# EAGLE design SparkFun_Wireless_JoyStick (EAGLE 7.6.0)

## Sheet 1 of 2
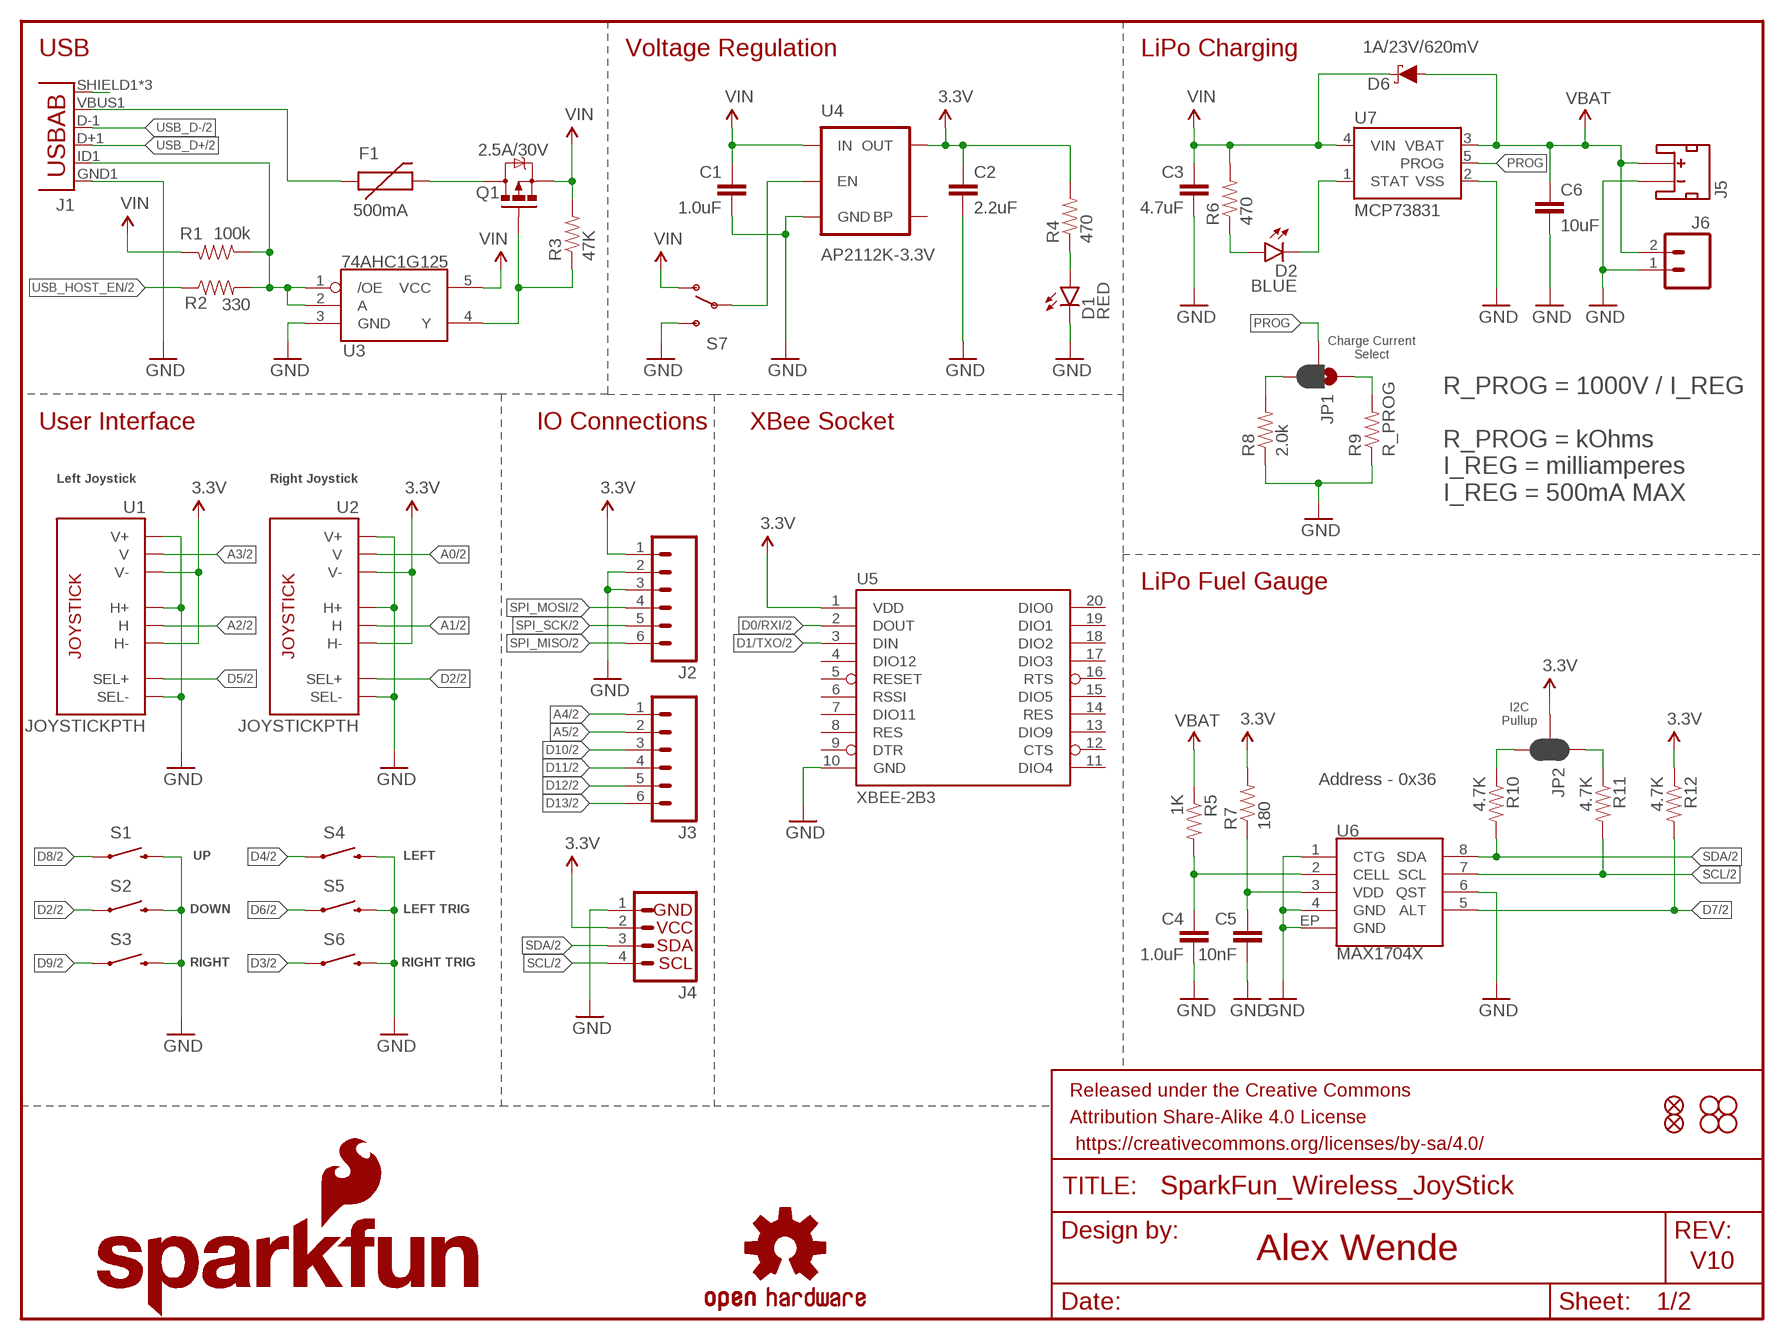
[diagram p0: schematic, sheet 1]

### Parts
C1  1.0uF  1.0UF-25V-+80/-20(0805)"  [0805-CAP]
C2  2.2uF  2.2UF-10V-20%(0603)  [0603-CAP]
C3  4.7uF  4.7UF-6.3V-10%(0603)0603  [0603-CAP]
C4  1.0uF  1.0UF-16V-10%(0603)  [0603-CAP]
C5  10nF  10NF/10000PF-50V-10%(0603)  [0603-CAP]
C6  10uF  10UF-6.3V-20%(0603)  [0603-CAP]
D1  RED  LED-RED0603  [LED-0603]
D2  BLUE  LED-BLUE0603  [LED-0603]
D6  1A/23V/620mV  DIODE-SCHOTTKY-BAT20J  [SOD-323]
F1  500mA  PTCSMD  [PTC-1206]
FD1  FIDUCIALUFIDUCIAL  [MICRO-FIDUCIAL]
FD2  FIDUCIALUFIDUCIAL  [MICRO-FIDUCIAL]
FRAME1  FRAME-LETTER  [CREATIVE_COMMONS]
H1  STAND-OFF  [STAND-OFF]
H2  STAND-OFF  [STAND-OFF]
H3  STAND-OFF  [STAND-OFF]
H4  STAND-OFF  [STAND-OFF]
J1  USB-ABCONN-11794  [USB-AB-MICRO-SMD_V03]
J2  M06NO_SILK_FEMALE_PTH  [1X06_NO_SILK]
J3  M06NO_SILK_FEMALE_PTH  [1X06_NO_SILK]
J4  I2C_STANDARD_NO_SILK  [1X04_NO_SILK]
J5  JST_2MM_MALE  [JST-2-SMD]
J6  M021X02_NO_SILK  [1X02_NO_SILK]
JP1  JUMPER-PAD-3-2OF3_NC_BY_PASTE  [PAD-JUMPER-3-2OF3_NC_BY_PASTE_YES_SILK_FULL_BOX]
JP2  JUMPER-PAD-3-NC_BY_PASTE  [PAD-JUMPER-3-NC_BY_PASTE_YES_SILK_FULL_BOX]
LOGO1  SFE_LOGO_NAME_FLAME.3_INCH  [SFE_LOGO_NAME_FLAME_.3]
LOGO2  OSHW-LOGOL  [OSHW-LOGO-L]
Q1  2.5A/30V  MOSFET-PCHANNELDMG2307L  [SOT23-3@1]
R1  100k  100KOHM-1/10W-1%(0603)  [0603-RES]
R2  330  330OHM1/10W1%(0603)  [0603-RES]
R3  47K  47KOHM1/10W1%(0603)  [0603-RES]
R4  470  470OHM1/10W1%(0603)  [0603-RES]
R5  1K  1KOHM-1/10W-1%(0603)  [0603-RES]
R6  470  470OHM1/10W1%(0603)  [0603-RES]
R7  180  180OHM1/10W1%(0603)  [0603-RES]
R8  2.0k  2.0KOHM1/10W5%(0603)  [0603-RES]
R9  R_PROG  RESISTORPTH-1/4W  [AXIAL-0.4]
R10  4.7K  4.7KOHM-1/10W-1%(0603)  [0603-RES]
R11  4.7K  4.7KOHM-1/10W-1%(0603)  [0603-RES]
R12  4.7K  4.7KOHM-1/10W-1%(0603)  [0603-RES]
S1  SWITCH-MOMENTARY-212MM  [TACTILE-PTH-12MM]
S2  SWITCH-MOMENTARY-212MM  [TACTILE-PTH-12MM]
S3  SWITCH-MOMENTARY-212MM  [TACTILE-PTH-12MM]
S4  SWITCH-MOMENTARY-212MM  [TACTILE-PTH-12MM]
S5  SWITCH-MOMENTARY-2SIDE_EZ  [TACTILE-PTH-SIDEEZ]
S6  SWITCH-MOMENTARY-2SIDE_EZ  [TACTILE-PTH-SIDEEZ]
S7  SWITCH_SPDT  [KPS-1290]
U1  JOYSTICKPTH  [JOYSTICK]
U2  JOYSTICKPTH  [JOYSTICK]
U3  74AHC1G125  [SOT23-5]
U4  AP2112K-3.3V  V_REG_LDOSMD  [SOT23-5]
U5  XBEE-2B3  [XBEE-SMD]
U6  MAX1704X  [TDFN-8]
U7  MCP73831  [SOT23-5]

### Nets
3.3V: C2.1 J2.1 J4.2 JP2.2 R4.2 R7.2 R12.1 U1.H3(H-) U1.V3(V-) U2.H3(H-) U2.V3(V-) U4.5(OUT) U5.1(VDD) ; also sheet 2
A0: U2.V2(V) ; also sheet 2
A1: U2.H2(H) ; also sheet 2
A2: U1.H2(H) ; also sheet 2
A3: U1.V2(V) ; also sheet 2
A4: J3.1 ; also sheet 2
A5: J3.2 ; also sheet 2
D0/RXI: U5.2(DOUT) ; also sheet 2
D1/TXO: U5.3(DIN) ; also sheet 2
D2: S2.1 U2.B1A(SEL+) ; also sheet 2
D3: S6.1 ; also sheet 2
D4: S4.1 ; also sheet 2
D5: U1.B1A(SEL+) ; also sheet 2
D6: S5.1 ; also sheet 2
D7: R12.2 U6.5(ALT) ; also sheet 2
D8: S1.1 ; also sheet 2
D9: S3.1 ; also sheet 2
D10: J3.3 ; also sheet 2
D11: J3.4 ; also sheet 2
D12: J3.5 ; also sheet 2
D13: J3.6 ; also sheet 2
GND: C1.2 C2.2 C3.2 C4.2 C5.2 C6.2 D1.C J1.GND1(GND) J2.2 J2.3 J4.1 J5.1(-) J6.1 R8.1 R9.P$1 S1.3 S2.3 S3.3 S4.3 S5.2 S6.2 S7.S U1.B2A(SEL-) U1.H1(H+) U1.V1(V+) U2.B2A(SEL-) U2.H1(H+) U2.V1(V+) U3.3(GND) U4.2(GND) U5.10(GND) U6.1(CTG) U6.4(GND) U6.6(QST) U6.EP(GND) U7.2(VSS) ; also sheet 2
N$2: JP2.1 R11.1
N$3: JP2.3 R10.1
N$4: JP1.1 R9.P$2
N$9: F1.1 J1.VBUS1(VBUS)
N$12: C5.1 R7.1 U6.3(VDD)
N$13: S7.P U4.3(EN)
N$14: F1.2 Q1.3(D)
N$15: J1.ID1(USBID) R1.1 R2.2 U3.1(/OE) U3.2(A)
N$16: C4.1 R5.2 U6.2(CELL)
N$17: JP1.3 R8.2
N$19: D2.A R6.1
N$20: D2.C U7.1(STAT)
N$23: D1.A R4.1
N$25: Q1.1(G) R3.1 U3.4(Y)
PROG: JP1.2 U7.5(PROG)
SCL: J4.4 R11.2 U6.7(SCL) ; also sheet 2
SDA: J4.3 R10.2 U6.8(SDA) ; also sheet 2
SHIELD: J1.SHIELD1(SHIELD) J1.SHIELD2(SHIELD) J1.SHIELD3(SHIELD)
SPI_MISO: J2.6 ; also sheet 2
SPI_MOSI: J2.4 ; also sheet 2
SPI_SCK: J2.5 ; also sheet 2
USB_D+: J1.D+1(D+) ; also sheet 2
USB_D-: J1.D-1(D-) ; also sheet 2
USB_HOST_EN: R2.1 ; also sheet 2
VBAT: C6.1 D6.A J5.2(+) J6.2 R5.1 U7.3(VBAT)
VIN: C1.1 C3.1 D6.C Q1.2(S) R1.2 R3.2 R6.2 S7.O U3.5(VCC) U4.1(IN) U7.4(VIN)
Unconnected: J5.NC1(PAD1) J5.NC2(PAD2) U4.4(BP) U5.4(DIO12) U5.5(RESET) U5.6(RSSI) U5.7(DIO11) U5.8(RES) U5.9(DTR) U5.11(DIO4) U5.12(CTS) U5.13(DIO9) U5.14(RES) U5.15(DIO5) U5.16(RTS) U5.17(DIO3) U5.18(DIO2) U5.19(DIO1) U5.20(DIO0)

### Notes on the sheet
- USB | Voltage Regulation | LiPo Charging
- Charge Current
  Select
- R_PROG = 1000V / I_REG
- User Interface | IO Connections | XBee Socket
- Left Joystick | Right Joystick
- R_PROG = kOhms
  I_REG = milliamperes
  I_REG = 500mA MAX
- LiPo Fuel Gauge
- I2C
  Pullup
- Address - 0x36
- UP | LEFT
- DOWN | LEFT TRIG
- RIGHT | RIGHT TRIG
- Alex Wende
- V10

## Sheet 2 of 2
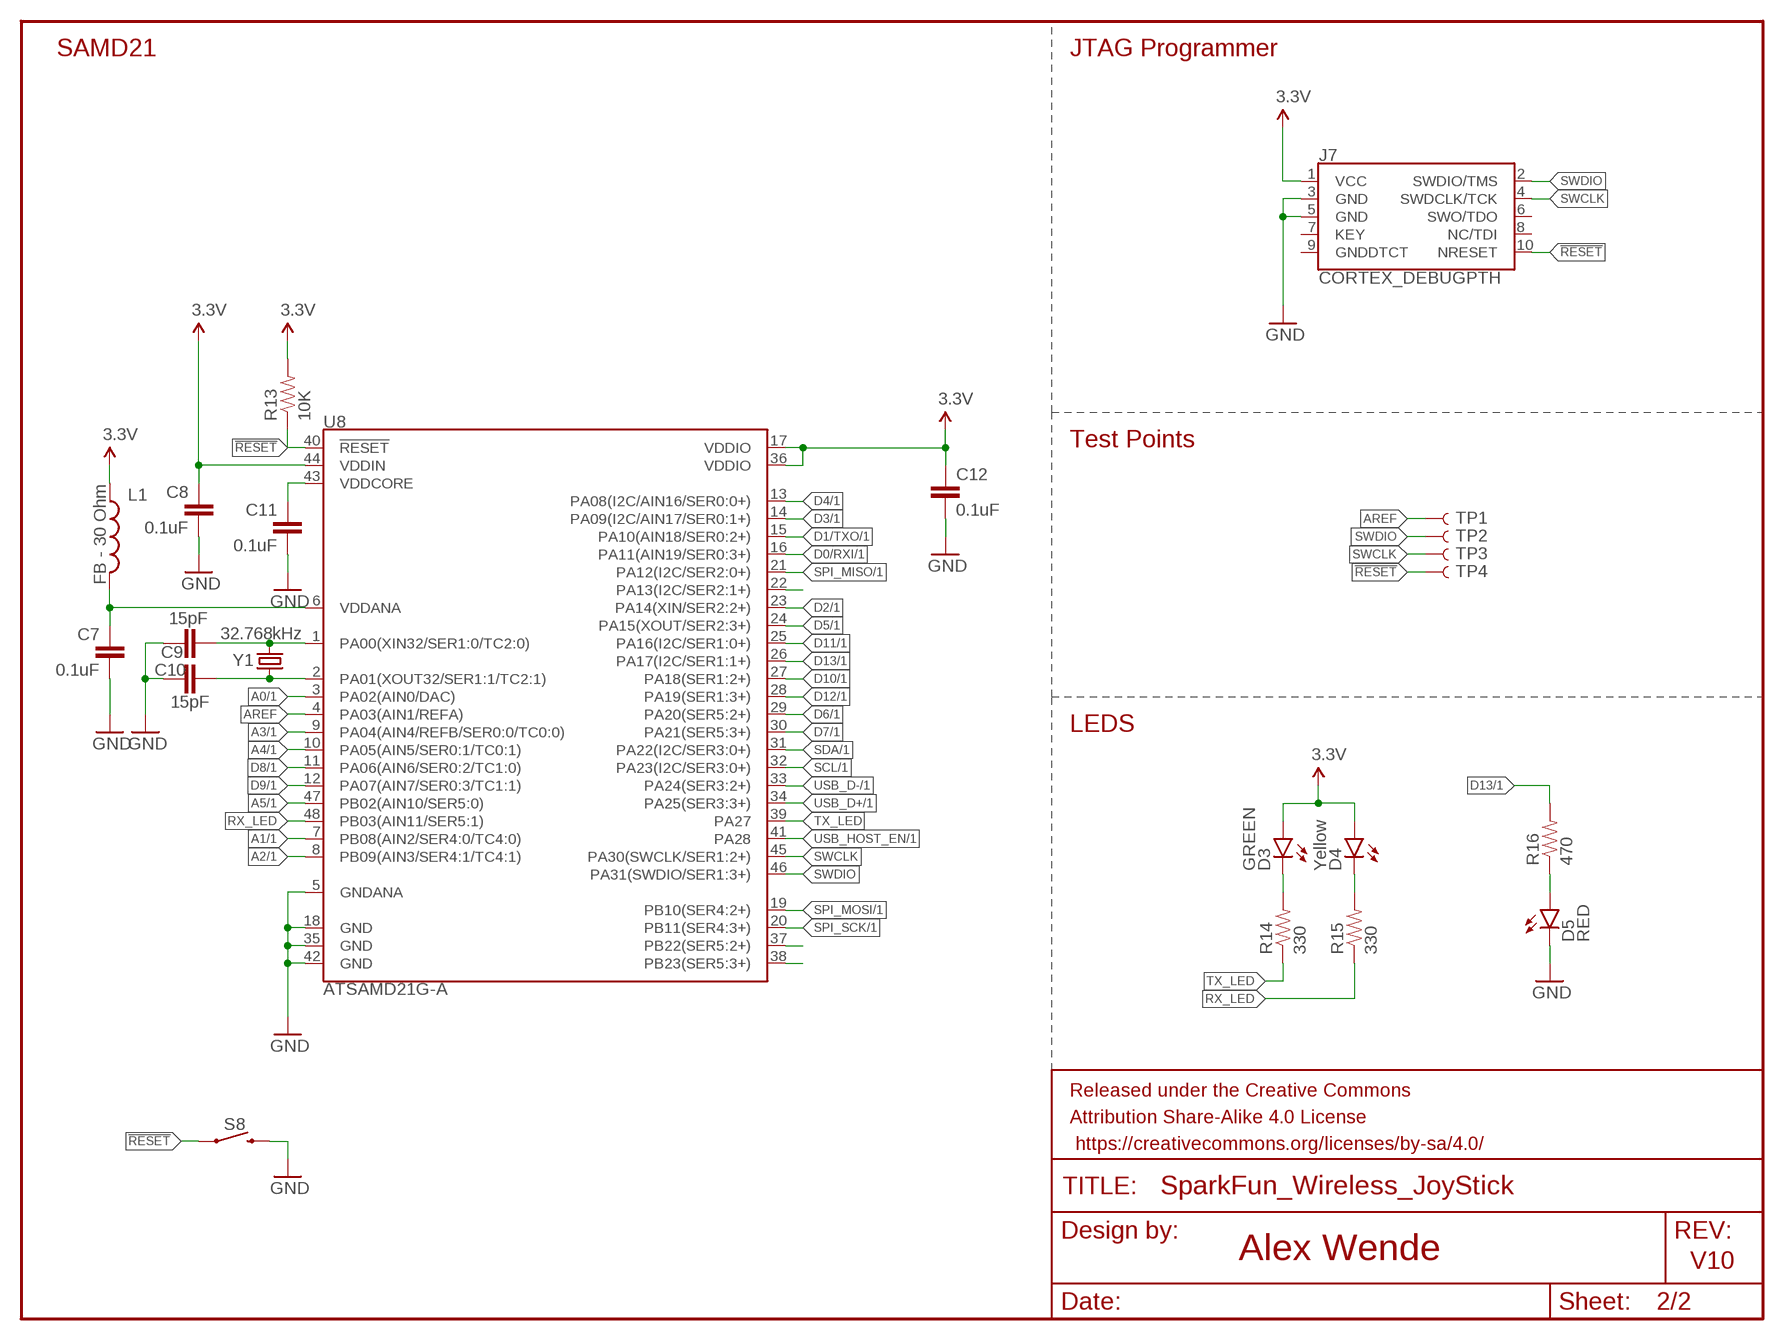
[diagram p1: schematic, sheet 2]

### Parts
C7  0.1uF  0.1UF-25V(+80/-20%)(0603)  [0603-CAP]
C8  0.1uF  0.1UF-25V(+80/-20%)(0603)  [0603-CAP]
C9  15pF  15PF-50V-5%(0603)  [0603-CAP]
C10  15pF  15PF-50V-5%(0603)  [0603-CAP]
C11  0.1uF  0.1UF-25V(+80/-20%)(0603)  [0603-CAP]
C12  0.1uF  0.1UF-25V(+80/-20%)(0603)  [0603-CAP]
D3  GREEN  LED-GREEN0603  [LED-0603]
D4  Yellow  LED-YELLOW0603  [LED-0603]
D5  RED  LED-RED0603  [LED-0603]
FRAME2  FRAME-LETTERNO_PACKAGE  [DUMMY]
J7  CORTEX_DEBUGPTH  [2X5-PTH-1.27MM]
L1  FB - 30 Ohm  INDUCTOR30OHM,1.8A  [0603]
R13  10K  10KOHM-1/10W-1%(0603)0603  [0603-RES]
R14  330  330OHM1/10W1%(0603)  [0603-RES]
R15  330  330OHM1/10W1%(0603)  [0603-RES]
R16  470  470OHM1/10W1%(0603)  [0603-RES]
S8  MOMENTARY-SWITCH-SPST-SMD-4.6X2.8MM  [TACTILE_SWITCH_SMD_4.6X2.8MM]
TP1  TEST-POINT3  [PAD.03X.03]
TP2  TEST-POINT3  [PAD.03X.03]
TP3  TEST-POINT3  [PAD.03X.03]
TP4  TEST-POINT3  [PAD.03X.03]
U8  ATSAMD21G-A  [TQFP-48]
Y1  32.768kHz  CRYSTAL3.2X1.5MM  [CRYSTAL-SMD-3.2X1.5MM]

### Nets
3.3V: C8.1 C12.1 D3.A D4.A J7.1(VCC) L1.1 R13.2 U8.17(VDDIO) U8.36(VDDIO) U8.44(VDDIN) ; also sheet 1
!RESET: J7.10(NRESET) R13.1 S8.1 S8.2 TP4.P$1 U8.40(!RESET!)
A0: U8.3(PA02(AIN0/DAC)) ; also sheet 1
A1: U8.7(PB08(AIN2/SER4:0/TC4:0)) ; also sheet 1
A2: U8.8(PB09(AIN3/SER4:1/TC4:1)) ; also sheet 1
A3: U8.9(PA04(AIN4/REFB/SER0:0/TC0:0)) ; also sheet 1
A4: U8.10(PA05(AIN5/SER0:1/TC0:1)) ; also sheet 1
A5: U8.47(PB02(AIN10/SER5:0)) ; also sheet 1
AREF: TP1.P$1 U8.4(PA03(AIN1/REFA))
D0/RXI: U8.16(PA11(AIN19/SER0:3+)) ; also sheet 1
D1/TXO: U8.15(PA10(AIN18/SER0:2+)) ; also sheet 1
D2: U8.23(PA14(XIN/SER2:2+)) ; also sheet 1
D3: U8.14(PA09(I2C/AIN17/SER0:1+)) ; also sheet 1
D4: U8.13(PA08(I2C/AIN16/SER0:0+)) ; also sheet 1
D5: U8.24(PA15(XOUT/SER2:3+)) ; also sheet 1
D6: U8.29(PA20(SER5:2+)) ; also sheet 1
D7: U8.30(PA21(SER5:3+)) ; also sheet 1
D8: U8.11(PA06(AIN6/SER0:2/TC1:0)) ; also sheet 1
D9: U8.12(PA07(AIN7/SER0:3/TC1:1)) ; also sheet 1
D10: U8.27(PA18(SER1:2+)) ; also sheet 1
D11: U8.25(PA16(I2C/SER1:0+)) ; also sheet 1
D12: U8.28(PA19(SER1:3+)) ; also sheet 1
D13: R16.2 U8.26(PA17(I2C/SER1:1+)) ; also sheet 1
GND: C7.2 C8.2 C9.1 C10.1 C11.2 C12.2 D5.C J7.3(GND) J7.5(GND) S8.3 S8.4 U8.5(GNDANA) U8.18(GND) U8.35(GND) U8.42(GND) ; also sheet 1
N$1: D4.C R15.2
N$5: U8.37(PB22(SER5:2+))
N$6: U8.38(PB23(SER5:3+))
N$7: D5.A R16.1
N$8: U8.22(PA13(I2C/SER2:1+))
N$10: D3.C R14.2
N$18: C11.1 U8.43(VDDCORE)
N$21: C9.2 U8.1(PA00(XIN32/SER1:0/TC2:0)) Y1.P$2
N$22: C10.2 U8.2(PA01(XOUT32/SER1:1/TC2:1)) Y1.P$1
N$24: C7.1 L1.2 U8.6(VDDANA)
RX_LED: R15.1 U8.48(PB03(AIN11/SER5:1))
SCL: U8.32(PA23(I2C/SER3:0+)) ; also sheet 1
SDA: U8.31(PA22(I2C/SER3:0+)) ; also sheet 1
SPI_MISO: U8.21(PA12(I2C/SER2:0+)) ; also sheet 1
SPI_MOSI: U8.19(PB10(SER4:2+)) ; also sheet 1
SPI_SCK: U8.20(PB11(SER4:3+)) ; also sheet 1
SWCLK: J7.4(SWDCLK/TCK) TP3.P$1 U8.45(PA30(SWCLK/SER1:2+))
SWDIO: J7.2(SWDIO/TMS) TP2.P$1 U8.46(PA31(SWDIO/SER1:3+))
TX_LED: R14.1 U8.39(PA27)
USB_D+: U8.34(PA25(SER3:3+)) ; also sheet 1
USB_D-: U8.33(PA24(SER3:2+)) ; also sheet 1
USB_HOST_EN: U8.41(PA28) ; also sheet 1
Unconnected: J7.6(SWO/TDO) J7.7(KEY) J7.8(NC/TDI) J7.9(GNDDTCT)

### Notes on the sheet
- SAMD21 | JTAG Programmer
- Test Points
- LEDS
- Alex Wende
- V10

## Library data of the parts
C1 = SparkFun-Capacitors:1.0UF-25V-+80/-20(0805): CAP-11625; PROD_ID: CAP-11625
C2 = SparkFun-Capacitors:2.2UF-10V-20%(0603): CAP-07888; PROD_ID: CAP-07888
C3 = SparkFun-Capacitors:4.7UF-6.3V-10%(0603): CAP-08280; PROD_ID: CAP-08280
C4 = SparkFun-Capacitors:1.0UF-16V-10%(0603): CAP-00868; PROD_ID: CAP-00868
C5 = SparkFun-Capacitors:10NF/10000PF-50V-10%(0603): CAP-00867; PROD_ID: CAP-00867
C6 = SparkFun-Capacitors:10UF-6.3V-20%(0603): CAP-11015; PROD_ID: CAP-11015
C7 C8 C11 C12 = SparkFun-Capacitors:0.1UF-25V(+80/-20%)(0603): CAP-00810 Ceramic Standard decoupling cap; PROD_ID: CAP-00810
C9 C10 = SparkFun-Capacitors:15PF-50V-5%(0603): CAP-07881; PROD_ID: CAP-07881
D1 D5 = SparkFun-LED:LED-RED: Assorted Red LEDs LilyPad 1206- DIO-09912 1206- DIO-00809 0603- DIO-00819 "SMART" means more efficient and expensive; PROD_ID: DIO-00819
D2 = SparkFun-LED:LED-BLUE: Blue LEDs for production use Various blue LEDs stocked by SparkFun production 0603 - DIO-08575 Rebel - DIO-09553 1206 - DIO-09911; PROD_ID: DIO-08575
D3 = SparkFun-LED:LED-GREEN: Various green LEDs Green LEDs used in SFE Production 0603- DIO-00821 LARGE- DIO-00862 LILYPAD- DIO-09910; PROD_ID: DIO-00821
D4 = SparkFun-LED:LED-YELLOW: Yellow SMD LEDs LilyPad 1206- DIO-09909 0603- DIO-09003 "SMART" means more efficient and expensive; PROD_ID: DIO-09003
D6 = SparkFun-DiscreteSemi:DIODE-SCHOTTKY: Schottky diode A Schottky diode is a semiconductor diode which has a low forward voltage drop and a very fast switching action.; PROD_ID: DIO-11623
F1 = SparkFun-PowerIC:PTC: Resettable Fuse PTC Resettable Fuse. Spark Fun Electronics SKU : COM-08357; PROD_ID: RES-11150
FD1 FD2 = SparkFun-Aesthetics:FIDUCIAL: Fiducial Alignment Points Various fiducial points for machine vision alignment.
FRAME1 = SparkFun-Aesthetics:FRAME-LETTER: Schematic Frame Standard 8.5x11 US Letter frame
FRAME2 = SparkFun-Aesthetics:FRAME-LETTER: Schematic Frame Standard 8.5x11 US Letter frame; DESIGNER: Nobody; VERSION: v01
H1-H4 = SparkFun-Electromechanical:STAND-OFF: #4 Stand Off This is the mechanical footprint for a #4 phillips button head screw. Use the keepout ring to avoid running the screw head into surrounding components. SKU : PRT-00447
J1 = SparkFun-Connectors:USB-AB: This is a USB AB connector that is compatible with USB OTG. i.e. this connector can serve as a host or device; PROD_ID: CONN-11794
J2 J3 = SparkFun-Connectors:M06: Header 6 Standard 6-pin 0.1" header. Use with straight break away headers (SKU : PRT-00116), right angle break away headers (PRT-00553), swiss pins (PRT-00743), machine pins (PRT-00117), and female headers (PRT-00115). Molex polarized connector foot print use with SKU : PRT-08094 with associated crimp pins and housings. NOTES ON THE VARIANTS LOCK and LOCK_LONGPADS... This footprint was designed to help hold the alignment of a through-hole component (i.e. 6-pin header) while soldering it into place. You may notice that each hole has been shifted either up or down by 0.005 of an inch from it's more standard position (which is a perfectly straight line). This slight alteration caused the pins (the squares in the middle) to touch the edges of the holes. Because they are alternating, it causes a "brace" to hold the component in place. 0.005 has proven to be the perfect amount of "off-center" position when using our standard breakaway headers. Although looks a little odd when you look at the bare footprint, once you have a header in there, the alteration is very hard to notice. Also,if you push a header all the way into place, it is covered up entirely on the bottom side. This idea of altering the position of holes to aid alignment will be further integrated into the Sparkfun Library for other footprints. It can help hold any component with 3 or more connection pins.; PROD_ID: CONN-08437
J4 = SparkFun-Connectors:I2C_STANDARD: SparkFun has standardized on a pinout for all I2C based sensor breakouts. This pinout allows I2C boards to be plugged directly into the headers on Arduino Uno compatible boards, and to be daisy chained easily.
J5 = SparkFun-Connectors:JST_2MM_MALE: Mates to single-cell LiPo batteries. CONN-11443 Now with smashable polarity marks!; BTM_NEG: -; BTM_POS: +; PROD_ID: CONN-11443; TOP_NEG: -; TOP_POS: +
J6 = SparkFun-Connectors:M02: Standard 2-pin 0.1" header. Use with - straight break away headers ( PRT-00116) - right angle break away headers (PRT-00553) - swiss pins (PRT-00743) - machine pins (PRT-00117) - female headers (PRT-00115) Molex polarized connector foot print use with: PRT-08233 with associated crimp pins and housings. 2.54_SCREWTERM for use with PRT-10571. 3.5mm Screw Terminal footprints for PRT-08084 5mm Screw Terminal footprints for use with PRT-08432
J7 = SparkFun-Connectors:CORTEX_DEBUG: Cortex Debug Connector Datasheet <http://infocenter.arm.com/help/topic/com.arm.doc.faqs/attached/13634/cortex_debug_connectors.pdf>
JP1 = SparkFun-Passives:JUMPER-PAD-3-2OF3_NC_BY_PASTE
JP2 = SparkFun-Passives:JUMPER-PAD-3-NC_BY_PASTE
L1 = SparkFun-Passives:INDUCTOR: Inductors Basic Inductor/Choke - 0603 and 1206. Footprints are not proven and vary greatly between part numbers. INDUCTOR POWER 3.3UH 4.0A SMD 0.197" L x 0.197" W x 0.177" H (5.00mm x 5.00mm x 4.50mm); PROD_ID: NDUC-07859
LOGO1 = SparkFun-Aesthetics:SFE_LOGO_NAME_FLAME: SFE Logo, name and flame This is the SparkFun full logo. The logo on the schematic will always be the same size; the package variant is the height of the flame part of the logo. Default layer for the logo on the board is tSilk.
LOGO2 = SparkFun-Aesthetics:OSHW-LOGO: Open Source Hardware Logo This logo indicates the piece of hardware it is found on incorporates a OSHW license and/or adheres to the definition of open source hardware found here: http://freedomdefined.org/OSHW
Q1 = SparkFun-DiscreteSemi:MOSFET-PCHANNEL: Generic PMOSFET IRLML2244 - TRANS-11153 (SOT-23 -20V -4.3A) (1.Gate 2.Source 3.Drain) FQP27P06 - COM-10349 <http://www.sparkfun.com/products/10349> (TO-220 -60V -27A) (1.Gate 2.Source 3.Drain); PROD_ID: TRANS-11308
R1 = SparkFun-Resistors:100KOHM-1/10W-1%(0603): RES-07828; PROD_ID: RES-07828
R2 R14 R15 = SparkFun-Resistors:330OHM1/10W1%(0603): RES-00818; PROD_ID: RES-00818
R3 = SparkFun-Resistors:47KOHM1/10W1%(0603): RES-07871; PROD_ID: RES-07871
R4 R6 R16 = SparkFun-Resistors:470OHM1/10W1%(0603): RES-07869; PROD_ID: RES-07869
R5 = SparkFun-Resistors:1KOHM-1/10W-1%(0603): RES-07856; PROD_ID: RES-07856
R7 = SparkFun-Resistors:180OHM1/10W1%(0603): RES-08788; PROD_ID: RES-08788
R8 = SparkFun-Resistors:2.0KOHM1/10W5%(0603): RES-08296; PROD_ID: RES-08296
R9 = SparkFun-Resistors:RESISTOR: Resistor Basic schematic elements and footprints for 0603, 1206, and PTH resistors.
R10-R12 = SparkFun-Resistors:4.7KOHM-1/10W-1%(0603): RES-07857; PROD_ID: RES-07857
R13 = SparkFun-Resistors:10KOHM-1/10W-1%(0603): RES-00824; PROD_ID: RES-00824
S1-S4 = SparkFun-Electromechanical:SWITCH-MOMENTARY-2: Various NO switches- pushbuttons, reed, etc; PROD_ID: SWCH-09185
S5 S6 = SparkFun-Electromechanical:SWITCH-MOMENTARY-2: Various NO switches- pushbuttons, reed, etc
S7 = SparkFun-Electromechanical:SWITCH_SPDT: SWCH-10651 Side-actuated SPDT slide switch, as used on the Arduino Pro; PROD_ID: SWCH-10651
S8 = SparkFun-Switches:MOMENTARY-SWITCH-SPST: Momentary Switch (Pushbutton) - SPST Normally-open (NO) SPST momentary switches (buttons, pushbuttons). Variants PTH-12MM - 12mm square, through-hole Momentary Pushbutton Switch - 12mm Square <https://www.sparkfun.com/products/9190> (COM-09190) PTH-6.0MM, PTH-6.0MM-KIT - 6.0mm square, through-hole Mini Pushbutton Switch <https://www.sparkfun.com/products/97> (COM-00097) KIT package intended for soldering kit's - only one side of pads' copper is exposed. PTH-RIGHT-ANGLE-KIT - Right-angle, through-hole Right Angle Tactile Button <https://www.sparkfun.com/products/10791> - Used on SparkFun BigTime Watch Kit <https://www.sparkfun.com/products/11734> SMD-12MM - 12mm square, surface-mount Tactile Button - SMD (12mm) <https://www.sparkfun.com/products/12993> (COM-12993) Used on SparkFun PicoBoard <https://www.sparkfun.com/products/11888> SMD-4.5MM - 4.5mm Square Trackball Switch Used on SparkFun Blackberry Trackballer Breakout <https://www.sparkfun.com/products/13169> SMD-4.6MMX2.8MM - 4.60mm x 2.80mm, surface mount Used on SparkFun SAMD21 Mini Breakout <https://www.sparkfun.com/products/13664> SMD-5.2MM, SMD-5.2-REDUNDANT - 5.2mm square, surface-mount Mini Pushbutton Switch - SMD <https://www.sparkfun.com/products/8720> (COM-08720) Used on Arduino Pro Mini <https://www.sparkfun.com/products/11114> REDUNDANT package connects both switch circuits together SMD-6.0X3.5MM - 6.0 x 3.5mm, surface mount Momentary Reset Switch SMD <https://www.sparkfun.com/products/8229> (COM-08229) SMD-6.2MM-TALL - 6.2mm square, surface mount Tactile Button - SMD (6mm) <https://www.sparkfun.com/products/12992> Used on SparkFun Digital Sandbox <https://www.sparkfun.com/products/12651> SMD-RIGHT-ANGLE - Right-angle, surface mount Used on SparkFun Block for Intel® Edison - Arduino <https://www.sparkfun.com/products/13036>; PROD_ID: SWCH-13065
TP1-TP4 = SparkFun-Passives:TEST-POINT: Bare copper test points for troubleshooting or ICT
U1 U2 = SparkFun-Electromechanical:JOYSTICK: Thumb Joystick Joystick commonly found in PS2 controllers. Two pots and a select switch. Footprint proven. Spark Fun Electronics SKU : COM-09032
U3 = SparkFun-DigitalIC:74AHC1G125: Single bus buffer gate with 3-state output; PROD_ID: IC-11920
U4 = SparkFun-PowerIC:V_REG_LDO: Voltage Regulator LDO Standard 150mA LDO voltage regulator in SOT-23 layout. Micrel part MIC5205. BP (by-pass) pin is used to lower output noise with 470pF cap.; PROD_ID: VREG-12457
U5 = SparkFun-RF:XBEE-2: Xbee module footprints SMT header is CONN-09042.; PROD_ID: CONN-09042
U6 = SparkFun-PowerIC:MAX1704X: MAX17043/MAX17044: Battery Fuel Guage (43 is 1cell, 44 is 2cell); PROD-ID: IC-10399
U7 = SparkFun-PowerIC:MCP73831: Miniature single cell, fully integrated Li-Ion, Li-polymer charge management controller http://ww1.microchip.com/downloads/en/DeviceDoc/20001984g.pdf IC-09995; PROD_ID: IC-09995
U8 = SparkFun-DigitalIC:ATSAMD21G: Atmel SAMD21G SMART ARM-Based Microcontroller The Atmel ® | SMART ™ SAM D21 is a series of low-power microcontrollers using the 32-bit ARM ® Cortex ® -M0+ processor, and ranging from 32- to 64-pins with up to 256KB Flash and 32KB of SRAM. The SAM D21 devices operate at a maximum frequency of 48MHz and reach 2.46 CoreMark/MHz. They are designed for simple and intuitive migration with identical peripheral modules, hex compatible code, identical linear address map and pin compatible migration paths between all devices in the product series. All devices include intelligent and flexible peripherals, Atmel Event System for inter-peripheral signaling, and support for capacitive touch button, slider and wheel user interfaces.; PROD_ID: IC-13064
Y1 = SparkFun-FreqCtrl:CRYSTAL: Various standard crystals. Proven footprints.; PROD_ID: XTAL-13062

## Board
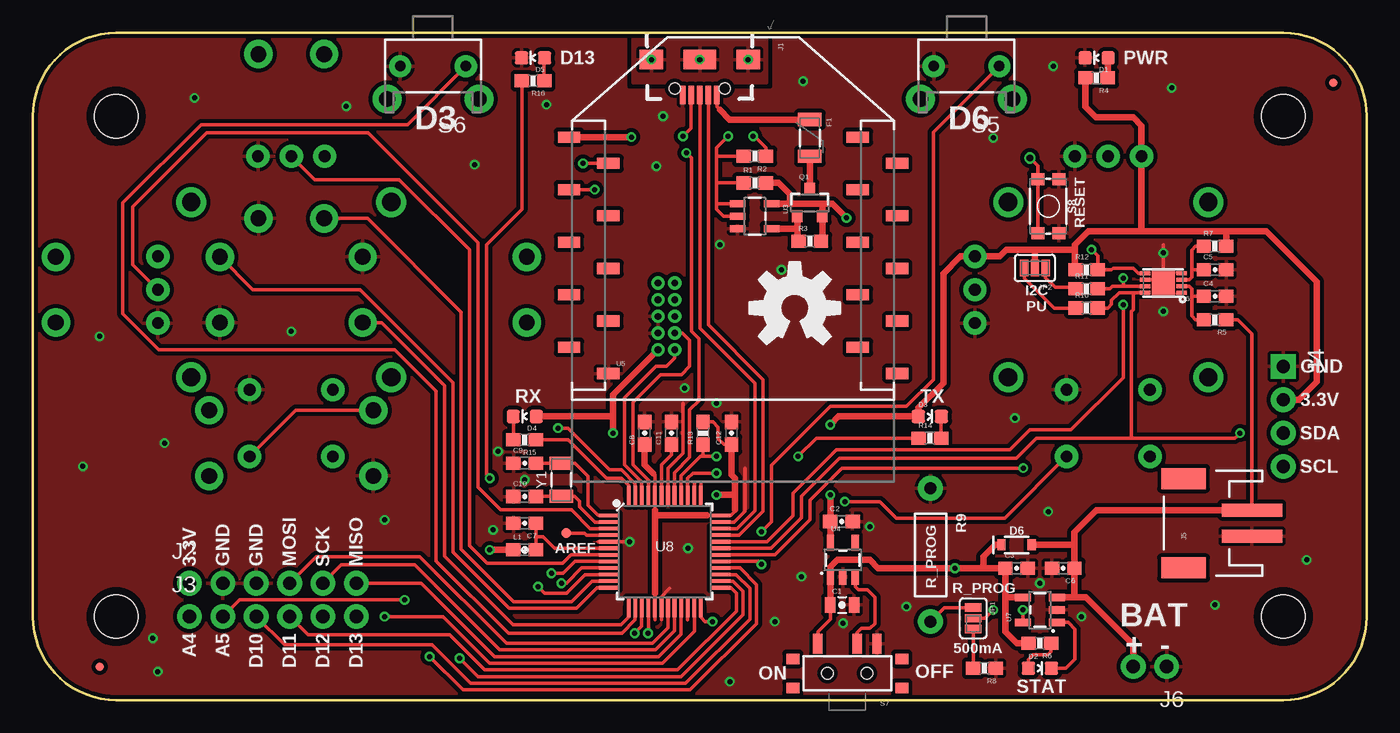
[diagram p2: board, top side]
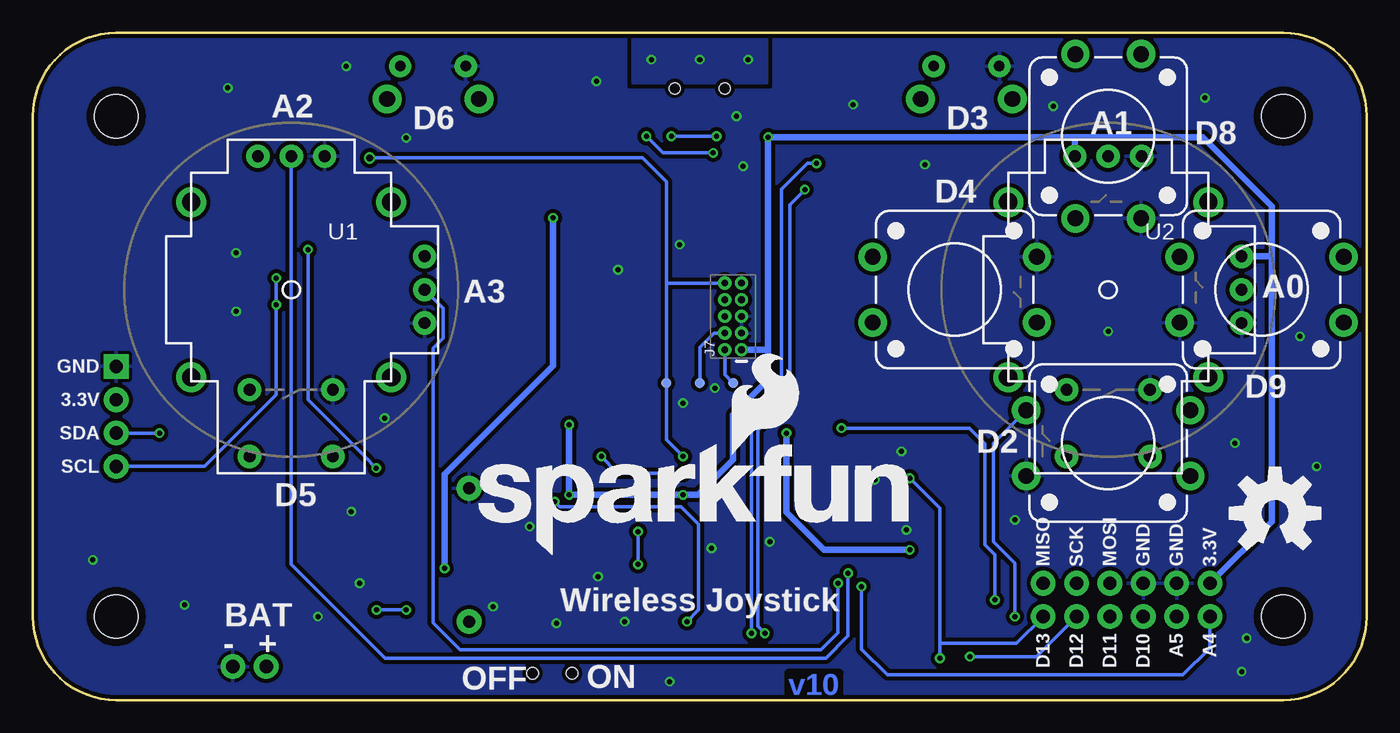
[diagram p3: board, bottom side, seen from below]

Size 101.6 x 50.8 mm. Coordinates in mm from the lower left corner, seen from the top.
Outline: 6.35,0 95.25,0 arc90 101.6,6.35 101.6,44.45 arc90 95.25,50.8 6.35,50.8 arc90 0,44.45 0,6.35 arc90 6.35,0
Copper layers (1*16): Top 0.035mm / dielectric 1.5mm / Bottom 0.035mm
Design rules "SparkFun-2-layer-TIGHT": minimum track width 7mil, minimum drill 15mil, track to track 7mil, track to pad 7mil, pad to pad 7mil, via to via 7mil, smd to smd 7mil, copper to edge 7mil, drill to drill 7mil, minimum pad ring 7mil, minimum via ring 7mil, stop-mask expansion 4mil, vias tented up to drill 25mil, thermal gap 10mil

### Footprints (pad centres in the part's own frame; a part is rotated, then mirrored left to right if it is on the bottom)
0805-CAP = smd 0.8 x 1.2: 1 -0.9,0; 2 0.9,0
0603-CAP = smd 1.1 x 1: 1 -0.85,0; 2 0.85,0
LED-0603 = smd 1 x 1: A 0,-0.877; C 0,0.877
SOD-323 = smd 0.63 x 0.83: A 1.15,0; C -1.15,0
PTC-1206 = smd 1 x 1.8: 1 -1.4,0; 2 1.4,0
MICRO-FIDUCIAL = smd 0.635 x 0.635: 1 0,0
STAND-OFF = hole 3.302: 0,0
USB-AB-MICRO-SMD_V03 = smd 1.4 x 0.4: D+1 2.7,0; D-1 2.7,0.65; GND1 2.7,-1.3; ID1 2.7,-0.65; VBUS1 2.7,1.3 | smd 1.5 x 1.8: SHIELD1 0,3.68; SHIELD3 0,-3.68 | smd 1.5 x 2.5: SHIELD2 0,0 | hole 0.85: 2.2,1.9; 2.2,-1.9
1X06_NO_SILK = drill 1.016 pad 1.88: 1 0,0; 2 2.54,0; 3 5.08,0; 4 7.62,0; 5 10.16,0; 6 12.7,0
1X04_NO_SILK = drill 1.016 pad 1.88 square: 1 0,0 | drill 1.016 pad 1.88: 2 2.54,0; 3 5.08,0; 4 7.62,0
JST-2-SMD = smd 1 x 4.6: 1 -1,-3.7; 2 1,-3.7 | smd 1.6 x 3.4: NC1 -3.4,1.5; NC2 3.4,1.5
1X02_NO_SILK = drill 1.016 pad 1.88: 1 0,0; 2 2.54,0
2X5-PTH-1.27MM = drill 0.508 pad 1: 1 -2.54,-0.635; 2 -2.54,0.635; 3 -1.27,-0.635; 4 -1.27,0.635; 5 0,-0.635; 6 0,0.635; 7 1.27,-0.635; 8 1.27,0.635; 9 2.54,-0.635; 10 2.54,0.635
PAD-JUMPER-3-2OF3_NC_BY_PASTE_YES_SILK_FULL_BOX = smd 0.635 x 1.27: 1 -0.813,0; 2 0,0; 3 0.813,0
PAD-JUMPER-3-NC_BY_PASTE_YES_SILK_FULL_BOX = smd 0.635 x 1.27: 1 -0.813,0; 2 0,0; 3 0.813,0
0603 = smd 1.1 x 1: 1 -0.85,0; 2 0.85,0
SOT23-3@1 = smd 0.8 x 0.9: 1 -0.95,-1; 2 0.95,-1; 3 0,1.1
0603-RES = smd 1.1 x 1: 1 -0.85,0; 2 0.85,0
AXIAL-0.4 = drill 0.9 pad 1.88: P$1 -5.08,0; P$2 5.08,0
TACTILE-PTH-12MM = drill 1.2 pad 2.159: 1 6.25,-2.5; 2 -6.25,-2.5; 3 6.25,2.5; 4 -6.25,2.5
TACTILE-PTH-SIDEEZ = drill 0.8 pad 1.7: 1 -2.5,0; 2 2.5,0 | drill 1.2 pad 2.2: ANCHOR1 -3.5,2.5; ANCHOR2 3.5,2.5
KPS-1290 = smd 0.7 x 1.5: O -2.25,2.25; P 0.75,2.25; S 2.25,2.25 | smd 1 x 0.8: P$1 -4.15,1.1; P$2 -4.15,-1.1; P$3 4.15,-1.1; P$4 4.15,1.1 | hole 0.9: -1.5,0; 1.5,0
TACTILE_SWITCH_SMD_4.6X2.8MM = smd 0.9 x 1: 1 -2.05,-0.8; 2 2.05,-0.8; 3 2.05,0.8; 4 -2.05,0.8
PAD.03X.03 = smd 0.762 x 0.762: P$1 0,0
JOYSTICK = drill 0.9 pad 1.778: B1A -3.175,12.7; B1B 3.175,12.7; B2A -3.175,7.62; B2B 3.175,7.62 | drill 0.889 pad 1.778: H1 -2.54,-10.16; H2 0,-10.16; H3 2.54,-10.16; V1 -10.16,2.54; V2 -10.16,0; V3 -10.16,-2.54 | drill 1.397 pad 2.286: MOUNT1 -7.62,6.668; MOUNT2 -7.62,-6.668; MOUNT3 7.62,-6.668; MOUNT4 7.62,6.668
SOT23-5 = smd 0.55 x 1.2: 1 -0.95,-1.3; 2 0,-1.3; 3 0.95,-1.3; 4 0.95,1.3; 5 -0.95,1.3
XBEE-SMD = smd 1.7 x 0.85: 1 -12.5,20; 2 -9.5,18; 3 -12.5,16; 4 -9.5,14; 5 -12.5,12; 6 -9.5,10; 7 -12.5,8; 8 -9.5,6; 9 -12.5,4; 10 -9.5,2; 11 12.5,2; 12 9.5,4; 13 12.5,6; 14 9.5,8; 15 12.5,10; 16 9.5,12; 17 12.5,14; 18 9.5,16; 19 12.5,18; 20 9.5,20
TDFN-8 = smd 0.8 x 0.3: 1 -1.4,0.75; 2 -1.4,0.25; 3 -1.4,-0.25; 4 -1.4,-0.75; 5 1.4,-0.75; 6 1.4,-0.25; 7 1.4,0.25; 8 1.4,0.75 | smd 1.73 x 1.88: EP 0,0
TQFP-48 = smd 1.5 x 0.28: 1 -4.25,2.75; 2 -4.25,2.25; 3 -4.25,1.75; 4 -4.25,1.25; 5 -4.25,0.75; 6 -4.25,0.25; 7 -4.25,-0.25; 8 -4.25,-0.75; 9 -4.25,-1.25; 10 -4.25,-1.75; 11 -4.25,-2.25; 12 -4.25,-2.75; 25 4.25,-2.75; 26 4.25,-2.25; 27 4.25,-1.75; 28 4.25,-1.25; 29 4.25,-0.75; 30 4.25,-0.25; 31 4.25,0.25; 32 4.25,0.75; 33 4.25,1.25; 34 4.25,1.75; 35 4.25,2.25; 36 4.25,2.75 | smd 0.28 x 1.5: 13 -2.75,-4.25; 14 -2.25,-4.25; 15 -1.75,-4.25; 16 -1.25,-4.25; 17 -0.75,-4.25; 18 -0.25,-4.25; 19 0.25,-4.25; 20 0.75,-4.25; 21 1.25,-4.25; 22 1.75,-4.25; 23 2.25,-4.25; 24 2.75,-4.25; 37 2.75,4.25; 38 2.25,4.25; 39 1.75,4.25; 40 1.25,4.25; 41 0.75,4.25; 42 0.25,4.25; 43 -0.25,4.25; 44 -0.75,4.25; 45 -1.25,4.25; 46 -1.75,4.25; 47 -2.25,4.25; 48 -2.75,4.25
CRYSTAL-SMD-3.2X1.5MM = smd 1 x 1.8: P$1 -1.25,0; P$2 1.25,0

### Placement (x,y rotation side)
C1  61.65,7.24 0 top
C2  61.59,13.59 0 top
C3  74.93,10.03 0 top
C4  90.04,30.73 0 top
C5  90.04,32.77 0 top
C6  78.49,10.03 180 top
C7  37.47,13.46 180 top
C8  46.61,20.32 90 top
C9  37.47,18.03 0 top
C10  37.47,15.49 0 top
C11  48.64,20.32 90 top
C12  53.21,20.32 90 top
D1  81.03,48.9 90 top
D2  76.71,2.41 270 top
D3  68.33,21.59 270 top
D4  37.47,21.59 90 top
D5  38.1,48.9 90 top
D6  74.93,11.81 0 top
F1  59.18,42.8 270 top
FD1  5.08,2.54 0 top
FD2  99.06,46.99 0 top
FRAME1  21.59,-15.24 0 top  (outside the outline)
FRAME2  21.59,-15.24 0 top  (outside the outline)
H1  6.35,44.45 0 top
H2  95.25,44.45 0 top
H3  95.25,6.35 0 top
H4  6.35,6.35 0 top
J1  50.8,48.77 270 top
J2  11.94,8.89 0 top
J3  11.94,6.35 0 top
J4  95.25,25.4 270 top
J5  89.15,13.46 90 top
J6  86.36,2.54 180 top
J7  48.26,29.21 90 bottom
JP1  71.63,6.22 270 top
JP2  76.33,32.89 180 top
L1  37.47,11.43 0 top
LOGO1  68.2,10.92 0 bottom
LOGO2  58.04,29.84 0 top
LOGO3  OSHW-LOGOL  [OSHW-LOGO-L]  6.99,14.22 0 bottom
Q1  59.18,37.85 0 top
R1  54.99,39.37 0 top
R2  54.99,41.4 180 top
R3  59.18,34.92 0 top
R4  81.03,47.37 180 top
R5  90.04,28.96 180 top
R6  76.71,4.32 180 top
R7  90.04,34.54 0 top
R8  72.49,2.41 180 top
R9  68.38,11.05 270 top
R10  80.26,29.84 0 top
R11  80.26,31.31 0 top
R12  80.26,32.77 0 top
R13  51.05,20.32 90 top
R14  68.33,19.94 0 top
R15  37.47,19.81 180 top
R16  38.1,47.16 180 top
S1  19.68,42.93 270 bottom
S2  19.68,19.56 180 bottom
S3  8,31.24 180 bottom
S4  31.37,31.24 0 bottom
S5  71.12,48.26 180 top
S6  30.48,48.26 180 top
S7  62.04,2.03 0 top
S8  77.34,37.59 270 top
TP1  40.64,12.7 0 top
TP2  48.26,24.13 0 bottom
TP3  50.8,24.13 0 bottom
TP4  53.34,24.13 0 bottom
U1  81.92,31.24 180 bottom
U2  19.68,31.24 180 bottom
U3  54.99,36.83 270 top
U4  61.7,10.67 0 top
U5  53.34,22.86 0 top
U6  86.11,31.75 180 top
U7  76.71,6.86 90 top
U8  48.13,11.3 0 top
Y1  40.26,16.76 90 top

### Tracks (layer width: path | path; a pad name or v marks a point on that pad's centre or on a via)
3.3V  (via drill 0.38)
  Top 0.254: 51.35,14.05 U8.36 53.16,14.05 53.47,14.36 53.47,14.48 | 47.38,14.47 U8.44 47.38,17.13 47.24,17.27 | 47.38,8.14 U8.17 47.38,6.1 | R13.2 51.81,21.17 52.2,20.78 52.2,19.91 52.63,19.47 C12.1
  Top 0.508: 47.38,8.14 47.38,14.05 | 47.38,14.05 47.38,14.47 | 51.35,14.05 47.38,14.05 | C8.1 46.61,17.91 47.24,17.27 | L1.1 v34.8,11.43 | U4.5 C2.1 v60.74,15.62 | J7.1 44.2,23.24 44.2,21.59 | 79.38,32.77 R12.1 79.38,32.8 79.38,34.29 | 84.45,35.69 80.4,35.69 79.38,34.66 79.38,34.29 | 90.89,35.69 84.45,35.69 | C12.1 53.21,17.14 53.47,16.89 53.47,15.62 | J4.2 96.42,22.86 97.79,24.23 97.79,31.85 93.96,35.69 90.89,35.69 | 90.89,35.69 R7.2 | R4.2 80.18,45.16 80.98,44.36 83.81,44.36 84.45,43.72 U1.H3 84.45,35.69 | v60.74,20.95 61.38,21.59 D3.A 67.45,22.23 69.34,24.13 69.34,32.47 70.65,33.78 U1.V3 73.66,33.78 74.17,34.29 76.33,34.29 | 53.47,15.62 53.47,14.48 | 53.47,15.62 v52.07,15.62 | v45.59,42.86 U5.1 | 44.2,21.59 v44.2,20.32 | D4.A 44.2,21.59 | JP2.2 76.33,34.29 | 76.33,34.29 79.38,34.29
  Bottom 0.508: v44.2,20.32 44.2,14.28 41.34,11.43 v34.8,11.43 | 45.59,26.67 v45.59,42.86 22.23,42.86 | 45.59,26.67 J7.1 | v60.74,20.95 v60.74,15.62 v52.07,15.62 50.94,15.62 48.26,18.3 48.26,21.72 45.59,24.38 45.59,26.67 | J2.1 7.24,13.59 7.24,33.78 | 22.23,42.86 12.5,42.86 7.24,37.6 7.24,33.78 | U2.H3 22.23,42.86 | U2.V3 7.24,33.78
!RESET  (via drill 0.38, 0.51)
  Top 0.254: U8.40 49.38,17.08 50.85,18.54 51.05,18.54 | 51.05,18.75 R13.1 51.05,18.54 | 51.05,18.54 v52.07,18.54 | S8.2 S8.1 76.54,40.68 v75.95,41.27
  Bottom 0.254: v52.07,18.54 53.34,19.81 TP4.P$1 53.34,31.75 | v75.95,41.27 55.15,41.27 53.34,39.47 53.34,31.75 | J7.10 53.34,31.75
A0
  Top 0.254: U2.V2 7.62,33.15 7.62,37.54 13.26,43.18 25.54,43.18 33.91,34.81 33.91,16.19 35.62,14.48 41.02,14.48 42.45,13.05 U8.3
A1
  Top 0.254: U2.H2 21.46,39.62 27.91,39.62 33.27,34.26 33.27,11.74 34.6,10.41 40.35,10.41 40.99,11.05 U8.7
A2  (via drill 0.38)
  Top 0.254: U8.8 41.29,10.55 40.39,9.65 v39.5,9.65
  Bottom 0.254: v39.5,9.65 39.5,4.88 41.21,3.17 74.75,3.17 81.92,10.34 U1.H2
A3  (via drill 0.38)
  Top 0.254: U8.9 41.8,10.05 40.64,8.89 v40.26,8.89
  Bottom 0.254: U1.V2 70.36,29.84 70.36,27.56 71.12,26.8 71.12,5.88 69.05,3.81 41.57,3.81 40.26,5.12 v40.26,8.89
A4  (via drill 0.38)
  Top 0.254: U8.10 42.06,9.55 40.64,8.13 38.99,8.13 v38.48,8.64
  Bottom 0.254: J3.1 11.94,3.95 13.99,1.91 36.51,1.91 38.48,3.88 v38.48,8.64
A5  (via drill 0.38)
  Top 0.254: U8.47 45.88,16.47 44.83,17.53 43.94,17.53 40.77,20.7 v40.01,20.7 | v28.32,7.62 15.75,7.62 J3.2
  Bottom 0.254: v40.01,20.7 30.25,20.7 29.08,19.53 29.08,11.81 28.32,11.05 v28.32,7.62
AREF
  Top 0.254: U8.4 42.18,12.55 42.04,12.7 TP1.P$1
D0/RXI  (via drill 0.38)
  Top 0.254: U8.16 46.88,5.1 v46.86,5.08 | U5.2 v41.91,40.86
  Bottom 0.254: v46.86,5.08 46.86,21.08 44.58,23.37 44.58,38.89 42.6,40.86 v41.91,40.86
D1/TXO  (via drill 0.38)
  Top 0.254: v45.85,5.08 46.38,5.62 U8.15 | v42.8,38.86 U5.3
  Bottom 0.254: v42.8,38.86 43.94,37.72 43.94,22.99 46.38,20.55 46.38,5.62 v45.85,5.08
D2  (via drill 0.38)
  Top 0.254: U8.23 50.38,5.23 47.95,2.79 34.8,2.79 31.24,6.35 v26.8,6.35 | U2.B1A 20.03,22.06 S2.1 25.95,22.06
  Bottom 0.254: v26.8,6.35 26.8,10.41 28.45,12.06 28.45,19.55 S2.1
D3
  Top 0.254: U8.14 45.88,6.1 44.87,5.08 36.23,5.08 30.73,10.57 30.73,23.5 27.56,26.67 9.61,26.67 6.86,29.42 6.86,37.85 12.83,43.81 28.54,43.81 S6.1
D4
  Top 0.254: S4.1 26.57,28.74 31.37,23.94 31.37,10.93 36.58,5.71 44.81,5.71 45.38,6.29 U8.13
D5  (via drill 0.38)
  Top 0.254: U1.B1A 74.04,13.84 65.79,13.84 64.52,15.11 v61.85,15.11 | U8.24 50.88,6.29 51.21,5.97 v51.77,5.97
  Bottom 0.254: v61.85,15.11 61.47,14.73 52.23,14.73 50.88,13.39 50.88,6.86 v51.77,5.97
D6  (via drill 0.38)
  Top 0.254: v55.5,12.83 56.26,13.59 56.26,17.86 60.75,22.35 66.55,22.35 68.58,24.38 68.58,43.22 S5.1 | U8.29 55.27,10.55 v55.5,10.32
  Bottom 0.254: v55.5,12.83 v55.5,10.32
D7  (via drill 0.38)
  Top 0.254: U8.30 53.34,11.05 56.52,11.05 59.18,13.72 59.18,15.21 61.62,17.65 v75.44,17.65 | U6.5 84.2,32.5 83.81,32.89 82.3,32.89 82.17,32.77 R12.2 81.11,33.82 v80.64,34.29
  Bottom 0.254: v80.64,34.29 80.64,22.88 76.33,18.56 76.33,18.54 v75.44,17.65
D8
  Top 0.254: S1.1 25.5,36.68 32.64,29.54 32.64,11.48 36.63,7.49 41.02,7.49 42.58,9.05 U8.11
D9
  Top 0.254: S3.1 14.26,33.74 16.76,31.24 24.93,31.24 32,24.17 32,11.25 36.27,6.99 41.4,6.99 42.97,8.55 U8.12
D10
  Top 0.254: U8.27 53.57,9.55 54.61,8.52 54.61,6.16 49.72,1.27 33.34,1.27 30.42,4.19 19.18,4.19 J3.3
D11
  Top 0.254: U8.25 53.18,8.55 53.59,8.13 53.59,6.78 49.1,2.29 34.42,2.29 31.75,4.95 20.95,4.95 J3.4
D12  (via drill 0.38)
  Top 0.254: U8.28 53.86,10.05 55.12,8.79 55.12,5.82 50.06,0.76 32.77,0.76 v30.23,3.3
  Bottom 0.254: v30.23,3.3 25.15,3.3 J3.5
D13  (via drill 0.38)
  Top 0.254: U8.26 53.34,9.05 54.1,8.29 54.1,6.49 49.39,1.78 33.91,1.78 v32.51,3.17 | R16.2 37.25,37.38 34.54,34.67 34.54,17.14 v34.8,16.89
  Bottom 0.254: J3.6 26.67,4.32 32.51,4.32 | v34.8,16.89 32.51,14.61 32.51,4.32 | 32.51,4.32 v32.51,3.17
GND  (via drill 0.38)
  Top 0.254: U8.42 48.38,17.65 49.53,18.8 49.53,22.61 | U8.35 53.39,13.55 54.23,14.39 54.23,17.65 | U6.6 86.11,32 86.11,34.67 | 48.51,8.51 47.88,7.88 U8.18 47.88,6.1 | v45.47,12.05 U8.5 43.06,12.05
  other vias: 49.91,11.56 35.05,12.95 35.43,18.92 49.66,23.75 3.81,17.78 63.75,13.21 61.72,5.84 66.55,7.11 47.5,40.64 52.32,34.67 57.02,32.77 48.01,44.45 39.12,45.34 58.67,47.12 77.34,14.35 90.04,7.24 97.03,10.67 79.88,6.35 52.07,22.61 73.15,42.8 77.72,48.26 86.74,46.61 23.88,45.21 12.32,45.85 5.08,27.69 19.68,28.07 26.8,13.72 9.14,4.7 74.8,21.46 76.71,8.89 86.11,34.04 86.11,29.59 10.03,19.56 9.53,2.16 53.09,1.4 56.52,5.97 58.55,9.4 37.47,16.76 33.66,40.77
  pour Top (isolate 0.305, rank 2): 0,0 0,50.8 101.6,50.8 101.6,0
  pour Bottom (isolate 0.305, rank 2): 0,0 0,50.8 101.6,50.8 101.6,0
N$1
  Top 0.254: D4.C 36.62,21.59 R15.2
N$2
  Top 0.254: 79.41,31.29 R11.1 79.41,31.42 77.88,31.42 77.14,32.16 JP2.1
N$3
  Top 0.254: 79.41,29.79 R10.1 77.8,29.84 75.51,32.13 JP2.3
N$4
  Top 0.254: JP1.1 69.44,7.04 R9.P$2
N$5
  Top 0.254: U8.37 50.88,16.51
N$6
  Top 0.254: U8.38 50.38,16.51
N$7
  Top 0.254: D5.A 38.95,48.9 R16.1
N$8
  Top 0.254: U8.22 49.88,6.1
N$9
  Top 0.254: J1.VBUS1 52.1,45.18 52.32,44.96
  Top 0.508: 52.32,44.96 53.08,44.2 F1.1
N$10
  Top 0.254: 69.18,21.59 R14.2
  Top 0.508: D3.C 69.18,21.59
N$12
  Top 0.254: R7.1 88.55,34.54 88.27,34.26 88.27,32.77 | 88.27,32.77 C5.1 | 88.27,32.77 88.27,32.18 88.08,32 U6.3
N$13
  Top 0.254: U4.3 62.65,8.63 62.9,8.38 63.57,8.38 64.14,7.81 64.14,5.82 63.78,5.46 63.11,5.46 62.79,5.14 S7.P
N$14
  Top 0.508: F1.2 Q1.3
N$15  (via drill 0.38)
  Top 0.254: R2.2 52.07,41.4 | 52.07,39.37 52.07,41.4 | 52.07,39.37 52.07,37.78 | 52.07,37.78 52.07,37.37 52.61,36.83 U3.2 | U3.1 52.07,37.78 | R1.1 52.07,39.37 | v49.53,42.93 50.15,43.55 J1.ID1 | v52.96,42.93 52.07,42.04 52.07,41.4
  Bottom 0.254: v52.96,42.93 v49.53,42.93
N$16
  Top 0.254: 88.27,30.73 C4.1 | R5.2 88.55,28.96 88.27,29.24 88.27,30.73 | 88.27,30.73 88.27,31.32 88.08,31.5 U6.2
N$17
  Top 0.254: JP1.3 71.64,5.41 R8.2
N$18
  Top 0.254: C11.1 48.64,18.67 47.88,17.91 U8.43
N$19
  Top 0.254: D2.A 75.83,3.08 76.18,3.43 77.31,3.43 77.56,3.68 R6.1
N$20
  Top 0.254: U7.1 78.86,5.91 79.38,5.39 79.38,3.1 78.69,2.41 D2.C
N$21
  Top 0.254: C9.2 38.31,18.01 Y1.P$2 41.3,18.01 42.29,17.02 42.29,14.82 43.05,14.05 U8.1
N$22
  Top 0.254: C10.2 38.31,15.51 Y1.P$1 41.27,15.51 41.66,15.13 41.66,14.71 42.81,13.55 U8.2
N$23
  Top 0.508: R4.1 81.9,47.4 D1.A
N$24
  Top 0.254: L1.2 38.31,12.45 | 38.31,12.45 C7.1 | U8.6 39.75,11.55 38.85,12.45 38.31,12.45
N$25
  Top 0.508: Q1.1 58.23,35.88 | 58.23,35.88 58.23,35.02 R3.1 | U3.4 58.23,35.88
PROG  (via drill 0.38)
  Top 0.254: JP1.2 72.52,6.22 v73.15,6.86 | v75.41,6.86 U7.5
  Bottom 0.254: v73.15,6.86 v75.41,6.86
RX_LED
  Top 0.254: R15.1 40.77,19.81 43.69,16.89 44.83,16.89 45.38,16.34 U8.48
SCL  (via drill 0.38)
  Top 0.254: U8.32 55.92,12.05 57.91,14.04 57.91,15.76 61.21,19.05 74.42,19.05 75.95,20.57 79.08,20.57 83.06,24.55 v83.06,30.1 | U6.7 83.06,31.5 | 83.06,31.5 v83.06,32.13 | R11.2 82.04,31.3 82.24,31.5 83.06,31.5
  Bottom 0.254: v83.06,32.13 v83.06,30.1 83.06,23.24 88.52,17.78 J4.4
SDA  (via drill 0.38)
  Top 0.254: R10.2 81.89,29.84 82.17,30.13 82.17,30.42 82.75,31 83.82,31 | 83.82,31 U6.8 | U8.31 56.21,11.55 58.55,13.89 58.55,15.53 61.43,18.41 74.93,18.41 76.45,19.94 83.69,19.94 | 83.69,19.94 83.69,29.59 83.82,29.72 83.82,31 | 83.69,19.94 91.57,19.94 v91.95,20.32
  Bottom 0.254: J4.3 v91.95,20.32
SHIELD  (via drill 0.38)
  other vias: 50.8,48.77 47.12,48.77 54.48,48.77
  pour Top (isolate 0.305): 45.72,50.8 55.88,50.8 55.88,46.99 45.72,46.99
  pour Bottom (isolate 0.305): 45.72,50.8 55.88,50.8 55.88,46.99 45.72,46.99
SPI_MISO
  Top 0.254: U8.21 49.38,5.01 47.67,3.3 35.18,3.3 29.59,8.89 J2.6
SPI_MOSI
  Top 0.254: U8.19 48.38,5.49 47.22,4.32 36.07,4.32 29.46,10.92 21.59,10.92 J2.4
SPI_SCK
  Top 0.254: U8.20 48.88,5.28 47.41,3.81 35.56,3.81 29.08,10.29 23.5,10.29 J2.5
SWCLK
  Top 0.254: U8.45 46.88,16.74 45.72,17.91 45.72,22.66 47.82,24.77 49.4,24.77 50.04,25.4 50.04,27.4 49.5,27.94 J7.4
  Bottom 0.254: TP3.P$1 50.8,26.86 49.72,27.94 J7.4
SWDIO
  Top 0.254: U8.46 46.38,16.61 45.09,17.91 45.09,23 47.48,25.4 48.26,25.4 48.9,26.04 J7.2
  Bottom 0.254: TP2.P$1 48.9,24.77 J7.2
TX_LED  (via drill 0.38)
  Top 0.254: U8.39 49.88,16.87 50.29,17.27 v52.07,17.27 | R14.1 59.69,19.94 v58.29,18.54
  Bottom 0.254: v52.07,17.27 57.15,17.27 arc-6 v58.29,18.54
USB_D+
  Top 0.254: J1.D+1 50.8,28.32 54.99,24.13 54.99,14.42 53.62,13.05 U8.34
USB_D-
  Top 0.254: J1.D-1 51.45,28.57 55.63,24.4 55.63,14.37 53.8,12.55 U8.33
USB_HOST_EN  (via drill 0.38)
  Top 0.254: R2.1 55.84,42.04 54.95,42.93 v54.86,42.93 | U8.41 48.88,17.31 50.04,18.47 50.04,22.1 50.74,22.8 50.74,27.5 50.16,28.07 50.16,41.27 v49.78,41.66
  Bottom 0.254: v54.86,42.93 53.59,41.66 v49.78,41.66
VBAT
  Top 0.254: R5.1 91.79,28.96 92.85,27.89 J5.2
  Top 0.508: 79.34,11.81 79.34,12.78 81.02,14.46 J5.2 92.96,14.46 | J6.2 83.82,4.21 80.23,7.81 U7.3 79.34,7.81 C6.1 79.34,11.43 79.34,11.81 | D6.A 79.34,11.81
VIN  (via drill 0.38)
  Top 0.254: S7.O 59.79,5.19 60.44,5.84 60.75,6.15 C1.1
  Top 0.508: R3.2 60.13,35.02 Q1.2 60.13,37.78 | U3.5 57.66,37.78 | R1.2 56.81,39.37 57.66,38.52 57.66,37.78 | R6.2 74.97,4.32 74.08,5.21 74.08,7.81 | 74.08,7.81 C3.1 72.39,10.03 | U7.4 74.08,7.81 | 72.39,10.03 v70.23,10.03 64.39,10.03 63.75,10.67 61.28,10.67 60.75,10.14 U4.1 C1.1 | 60.13,37.78 60.92,37.78 61.98,36.72 v61.98,36.7 | 60.13,37.78 57.66,37.78 | D6.C 73.31,11.81 72.39,10.89 72.39,10.03
  Bottom 0.508: v70.23,10.03 70.23,17.2 61.98,25.45 v61.98,36.7

### Text on the board
Bottom: v10
tPlace: D13 | PWR | D3 | D6 | RESET | I2C / PU | GND | RX | TX | 3.3V | SDA | SCL | AREF | 3.3V | GND | GND | MOSI | SCK | MISO | R_PROG | BAT | A4 | A5 | D10 | D11 | D12 | D13 | 500mA | + | - | ON | OFF | STAT
bPlace: A2 | A1 | D3 | D6 | D8 | D4 | A0 | A3 | GND | D9 | 3.3V | SDA | D2 | SCL | D5 | 3.3V | GND | GND | MOSI | SCK | MISO | Wireless Joystick | BAT | A4 | A5 | D10 | D11 | D12 | D13 | + | - | ON | OFF
Measures: Units in Inches
tDocu: Alex Wende